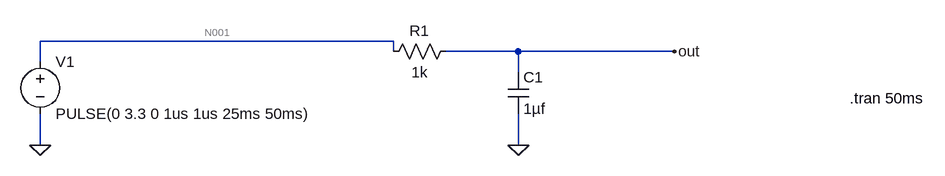
[diagram p0: schematic filter.asc]
filter.asc, the LTspice schematic file:
Version 4
SHEET 1 880 680
WIRE -192 0 -736 0
WIRE -192 16 -192 0
WIRE 0 16 -112 16
WIRE 240 16 0 16
WIRE -736 32 -736 0
WIRE 0 48 0 16
WIRE -736 160 -736 112
WIRE 0 160 0 112
FLAG 0 160 0
FLAG -736 160 0
FLAG 240 16 out
SYMBOL res -96 0 R90
WINDOW 0 0 56 VBottom 2
WINDOW 3 32 56 VTop 2
SYMATTR InstName R1
SYMATTR Value 1k
SYMBOL cap -16 48 R0
SYMATTR InstName C1
SYMATTR Value 1µf
SYMBOL voltage -736 16 R0
WINDOW 123 0 0 Left 0
WINDOW 39 0 0 Left 0
SYMATTR InstName V1
SYMATTR Value PULSE(0 3.3 0 1us 1us 25ms 50ms)
TEXT 510 88 Left 2 !.tran 50ms

The netlist it stands for:
* filter.asc
R1 out N001 1k
C1 out 0 1µf
V1 N001 0 PULSE(0 3.3 0 1us 1us 25ms 50ms)
.tran 50ms
.backanno
.end

* Results of the author's LTspice run, read from the files saved beside the schematic
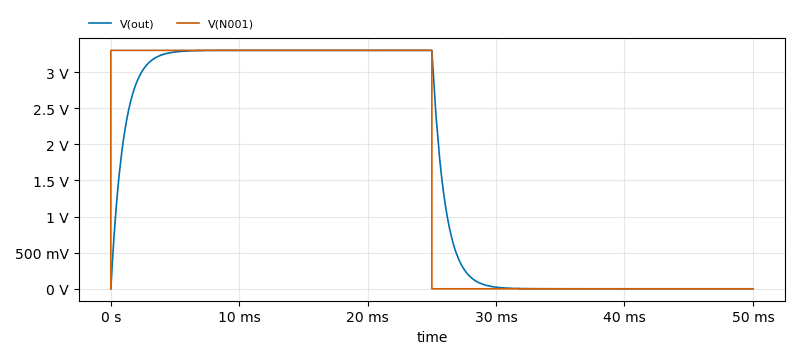
[diagram p1: Transient Analysis of filter.asc, plotted from the saved traces]
* Transient Analysis, 1 run:
*   V(out): min 0 V, max 3.3 V, average 1.65 V, rms 2.287 V, last 0 V
*   V(N001): min 0 V, max 3.3 V, average 1.65 V, rms 2.333 V, last 0 V